# Altium schematic sheet 01 - Main.SchDoc: NRF Sensor
size A4; DocumentNumber: 1; Revision: 1.0.0; SheetNumber: 1; SheetTotal: 1
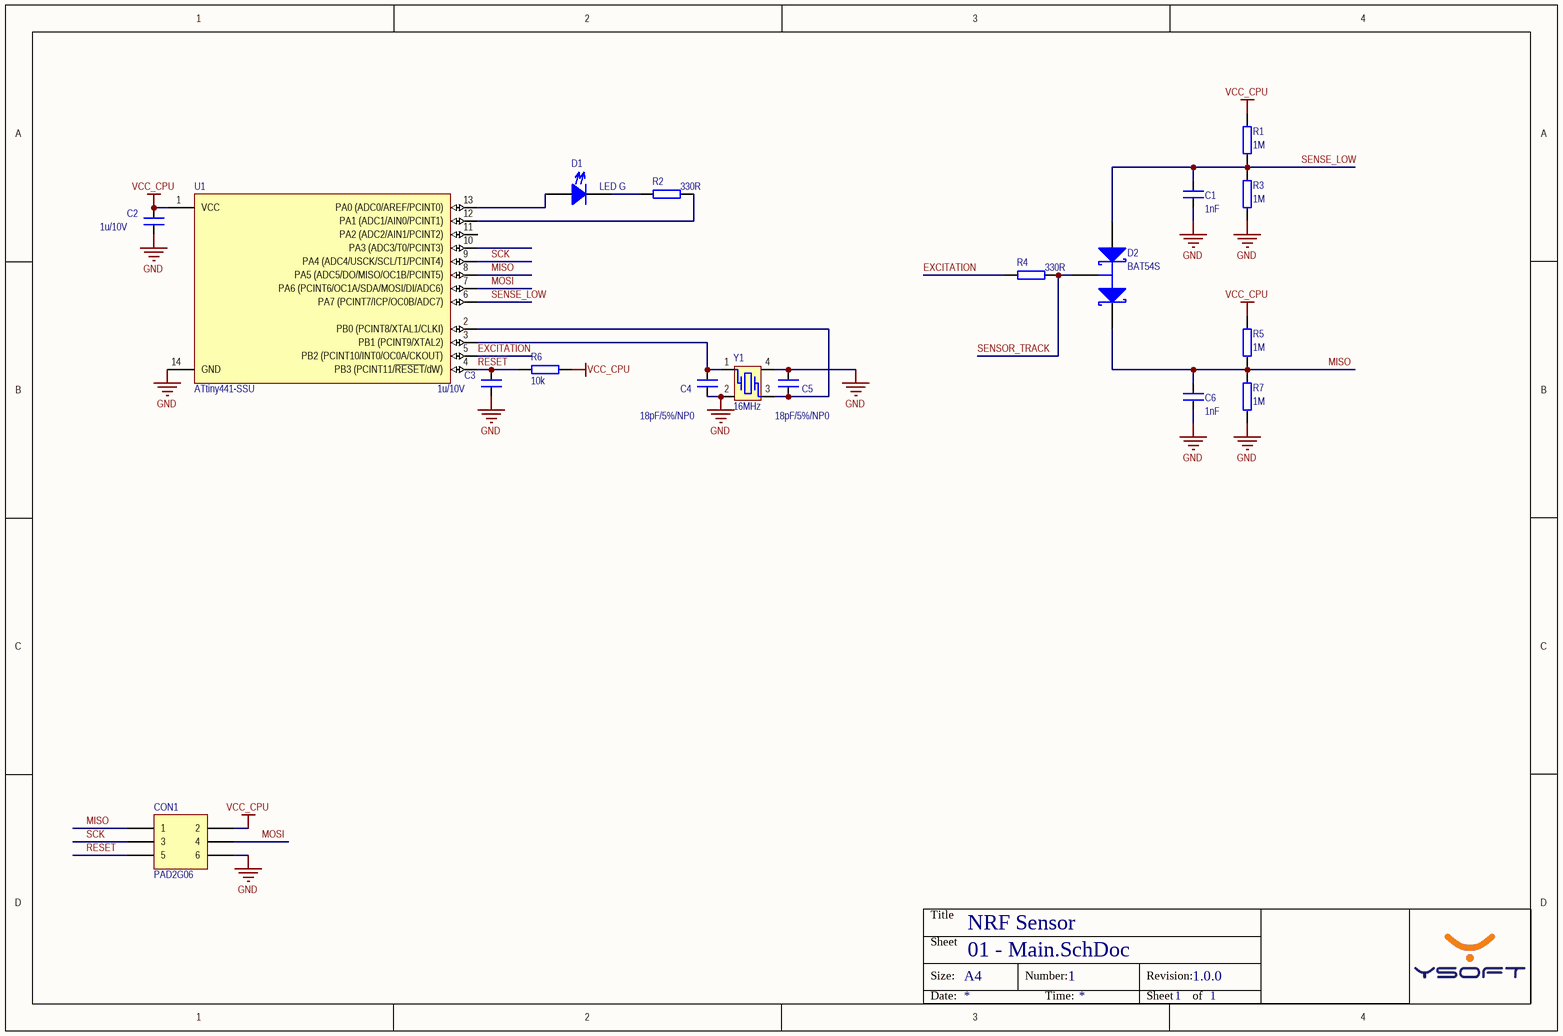
[diagram p0: 01 - Main.SchDoc]

## Parts
C1  1nF  [C-0603]
C2  1u/10V  [C-0603]
C3  1u/10V  [C-0603]
C4  18pF/5%/NP0  [C-0603]
C5  18pF/5%/NP0  [C-0603]
C6  1nF  [C-0603]
CON1  PAD2G06  [HDR2X06S]
D1  LED G  [LED-0603 GREEN]
D2  BAT54S  [FAIR-SOT23-3_V]
R1  1M  [R-0603]
R2  330R  [R-0603]
R3  1M  [R-0603]
R4  330R  [R-0603]
R5  1M  [R-0603]
R6  10k  [R-0603]
R7  1M  [R-0603]
U1  ATtiny441-SSU  [14S1_M]
Y1  16MHz  [ASX3F]

## Nets
GND: C1.1 C2.1 C3.1 C4.1 C5.2 C6.1 CON1.6 R3.1 R7.1 U1.14(GND) Y1.2 Y1.4
VCC_CPU: C2.2 CON1.2 R1.2 R5.2 R6.2 U1.1(VCC)
EXCITATION: R4.1 U1.5(PB2_(PCINT10/INT0/OC0A/CKOUT))
MISO: C6.2 CON1.1 D2.2(K) R5.1 R7.2 U1.8(PA5_(ADC5/DO/MISO/OC1B/PCINT5))
MOSI: CON1.4 U1.7(PA6_(PCINT6/OC1A/SDA/MOSI/DI/ADC6))
RESET: C3.2 CON1.5 R6.1 U1.4(PB3_(PCINT11/~{RESET}/dW))
SCK: CON1.3 U1.9(PA4_(ADC4/USCK/SCL/T1/PCINT4))
SENSE_LOW: C1.2 D2.1(A) R1.1 R3.2 U1.6(PA7_(PCINT7/ICP/OC0B/ADC7))
SENSOR_TRACK: D2.3(C) R4.2
NetC4_2: C4.2 U1.3(PB1_(PCINT9/XTAL2)) Y1.1
NetC5_1: C5.1 U1.2(PB0_(PCINT8/XTAL1/CLKI)) Y1.3
NetD1_1: D1.1(K) R2.1
NetD1_2: D1.2(A) U1.13(PA0_(ADC0/AREF/PCINT0))
NetR2_2: R2.2 U1.12(PA1_(ADC1/AIN0/PCINT1))

Not connected (* = marked no-connect by the designer): U1 10(PA3_(ADC3/T0/PCINT3)) 11(PA2_(ADC2/AIN1/PCINT2))

## Notes on the sheet
- Title
- Size:
- Sheet
- A4
- Number:
- Revision:
- Date:
- Time:
- of

## Library data of the parts
C1 C6 = CMP-00261-4: SMD Ceramic Capacitor 0603 1nF/100V/5%; Helios ID: CAP-0603 1nF/100V/5%; Type: SMT; IFS PN: 101148; Package: 0603
C2 C3 = CMP-00263-4: SMD Ceramic Capacitor 0603 1u/10V; Helios ID: CAP-0603 1u/10V; Type: SMT; IFS PN: 105623; Package: 0603
C4 C5 = CMP-00260-4: SMD Ceramic Capacitor 0603 18pF/5%/NP0; Helios ID: CAP-0603 18pF/5%/NP0; Type: SMT; IFS PN: 102556; Package: 0603
CON1 = CMP-00360-3: 2x3pin dual row pads, 2.54mm; Helios ID: CON-PAD2G06; Type: TH
D1 = CMP-00413-5: LED; SMD; 0603; zelená; 4-15mcd; 1,6x0,8x1,1mm; 120°; 2,2÷2,5V; 20mA; Helios ID: DIO-KP-1608SGC; IFS PN: 114766; Type: SMT; Package: LED-0603
D2 = CMP-1670-00010-1: Schottky Barrier Diode, 30 V, 0.2 A, -55 to 150 degC, 3-Pin SOT23, RoHS, Tape and Reel; ESR: 40 Ohm; Frequency: 16 MHz; Load Capacitance: 18 pF; Tolerance: 30ppm; Capacitance: 1.8E-11 f; Pins: 4; Length: 5 mm; ComponentLink3URL: http://www.fairchildsemi.com/dwg/MA/MA03D.pdf; RoHSCompliant: True; REACH SVHC: No SVHC; ComponentLink1URL: https://www.fairchildsemi.com/; Width: 3.2 mm; PackageDescription: 3-Pin Small Outline Transistor, Body 2.92 x 1.325 mm, Pitch 0.95 mm; ComponentLink2Description: Datasheet; Resistance: 40 Ohm; Max Operating Temperature: 70degC; ComponentLink2URL: https://www.fairchildsemi.com/datasheets/BA/BAT54S.pdf; Min Operating Temperature: -10degC; DatasheetVersion: Rev. 2.3, 04/2016; PackageReference: SOT23-3; Height: 0.9 mm; Frequency Tolerance: 30ppm; ComponentLink1Description: Manufacturer URL; Packaging: Tape and Reel; Mount: Surface Mount; Package Quantity: 1000; ComponentLink3Description: Package Specification
R1 R3 R5 R7 = CMP-00067-5: SMD Resistor 0603 1M; Helios ID: RES-0603 1M; IFS PN: 103343; Value: 1M; Type: SMT; Package: 0603
R2 R4 = CMP-00084-5: SMD Resistor 0603 330R; Value: 330; Helios ID: RES-0603 330R; IFS PN: 102576; Type: SMT; Package: 0603
R6 = CMP-00036-5: SMD Resistor 0603 10k; Helios ID: RES-0603 10k; IFS PN: 100043; Value: 10k; Type: SMT; Package: 0603
U1 = CMP-0093-00132-2: 8-bit AVR Microcontroller, 20MHz, 2.7-5.5V, 4KB Flash, 256 Bytes EEPROM, 256 Bytes SRAM, 14-pin SOIC, Industrial Grade (-40°C to 85°C), Pb-Free; Code_IPC: SOIC127P600-14; DatasheetVersion: revK, Oct-2010; ComponentLink3URL: http://www.atmel.com/dyn/resources/prod_documents/8006S.pdf; RevisionNote: DatasheetVersion updated. Removed ComponentAvailability note. URLs added.; PackageReference: 14S1; PackageVersion: revA, Feb-2002; ComponentLink3Description: ATtiny24/44/84 Summary; ComponentLink2Description: ATtiny24/44/84 Datasheet; Code_JEDEC: MS-012-AB; ComponentLink1Description: Manufacturer URL; ComponentLink1URL: http://www.atmel.com/; ComponentLink2URL: http://www.atmel.com/dyn/resources/prod_documents/doc8006.pdf; PackageDescription: 14-Lead, 0.150â€ Wide Body, Plastic Gull Wing Small Outline Package (SOIC)
Y1 = CMP-00507-4: Crystal 16 MHz SMD, package 3.2x2.5mm; Helios ID: CRY-ASX3F-16M-FE140E3; IFS PN: 100681; Type: SMT